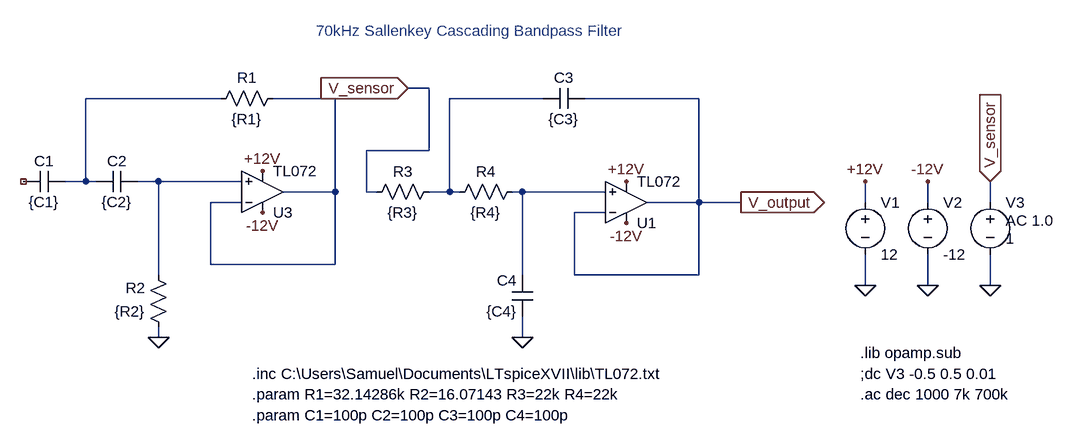
[diagram p0: schematic SallenKeyBandPassFIlter (Two Op Amp).asc]
SallenKeyBandPassFIlter (Two Op Amp).asc, the LTspice schematic file:
Version 4
SHEET 1 2508 680
WIRE -800 -528 -832 -528
WIRE -1120 -512 -1328 -512
WIRE -944 -512 -1040 -512
WIRE -624 -512 -768 -512
WIRE -384 -512 -560 -512
WIRE -800 -432 -800 -528
WIRE -800 -432 -896 -432
WIRE -1328 -384 -1328 -512
WIRE -1328 -384 -1360 -384
WIRE -1312 -384 -1328 -384
WIRE -1216 -384 -1248 -384
WIRE -1088 -384 -1216 -384
WIRE -944 -368 -944 -512
WIRE -944 -368 -1024 -368
WIRE -896 -368 -896 -432
WIRE -880 -368 -896 -368
WIRE -768 -368 -768 -512
WIRE -768 -368 -800 -368
WIRE -752 -368 -768 -368
WIRE -656 -368 -672 -368
WIRE -528 -368 -656 -368
WIRE -1088 -352 -1136 -352
WIRE -384 -352 -384 -512
WIRE -384 -352 -464 -352
WIRE -320 -352 -384 -352
WIRE -128 -352 -128 -384
WIRE -32 -352 -32 -384
WIRE 64 -352 64 -384
WIRE -528 -336 -576 -336
WIRE -1136 -256 -1136 -352
WIRE -944 -256 -944 -368
WIRE -944 -256 -1136 -256
WIRE -1216 -240 -1216 -384
WIRE -656 -240 -656 -368
WIRE -576 -240 -576 -336
WIRE -384 -240 -384 -352
WIRE -384 -240 -576 -240
WIRE -128 -224 -128 -272
WIRE -32 -224 -32 -272
WIRE 64 -224 64 -272
WIRE -1216 -144 -1216 -160
WIRE -656 -144 -656 -176
FLAG -32 -224 0
FLAG -128 -224 0
FLAG -128 -384 +12V
FLAG -32 -384 -12V
FLAG -320 -352 V_output
IOPIN -320 -352 Out
FLAG -1056 -400 +12V
FLAG -1056 -336 -12V
FLAG -832 -528 V_sensor
IOPIN -832 -528 In
FLAG 64 -224 0
FLAG 64 -384 V_sensor
IOPIN 64 -384 In
FLAG -1216 -144 0
FLAG -496 -384 +12V
FLAG -496 -320 -12V
FLAG -656 -144 0
SYMBOL voltage -128 -368 R0
WINDOW 123 0 0 Left 2
WINDOW 39 0 0 Left 2
SYMATTR InstName V1
SYMATTR Value 12
SYMBOL voltage -32 -368 R0
WINDOW 123 0 0 Left 2
WINDOW 39 0 0 Left 2
SYMATTR InstName V2
SYMATTR Value -12
SYMBOL Opamps\\opamp2 -1056 -304 M180
SYMATTR InstName U3
SYMATTR Value TL072
SYMBOL cap -1360 -400 R90
WINDOW 0 0 32 VBottom 2
WINDOW 3 32 32 VTop 2
SYMATTR InstName C1
SYMATTR Value {C1}
SYMBOL cap -1312 -368 R270
WINDOW 0 32 32 VTop 2
WINDOW 3 0 32 VBottom 2
SYMATTR InstName C2
SYMATTR Value {C2}
SYMBOL voltage 64 -368 R0
WINDOW 123 24 44 Left 2
WINDOW 39 0 0 Left 2
WINDOW 3 24 72 Left 2
SYMATTR Value2 AC 1.0
SYMATTR Value 1
SYMATTR InstName V3
SYMBOL res -1024 -528 R90
WINDOW 0 0 56 VBottom 2
WINDOW 3 32 56 VTop 2
SYMATTR InstName R1
SYMATTR Value {R1}
SYMBOL res -1200 -144 R180
WINDOW 0 36 76 Left 2
WINDOW 3 36 40 Left 2
SYMATTR InstName R2
SYMATTR Value {R2}
SYMBOL Opamps\\opamp2 -496 -288 M180
SYMATTR InstName U1
SYMATTR Value TL072
SYMBOL res -784 -384 R90
WINDOW 0 0 56 VBottom 2
WINDOW 3 32 56 VTop 2
SYMATTR InstName R3
SYMATTR Value {R3}
SYMBOL res -656 -384 R90
WINDOW 0 0 56 VBottom 2
WINDOW 3 32 56 VTop 2
SYMATTR InstName R4
SYMATTR Value {R4}
SYMBOL cap -560 -528 R90
WINDOW 0 0 32 VBottom 2
WINDOW 3 32 32 VTop 2
SYMATTR InstName C3
SYMATTR Value {C3}
SYMBOL cap -640 -176 R180
WINDOW 0 24 56 Left 2
WINDOW 3 24 8 Left 2
SYMATTR InstName C4
SYMATTR Value {C4}
TEXT -136 -120 Left 2 !.lib opamp.sub
TEXT -736 -616 Center 2 ;70kHz Sallenkey Cascading Bandpass Filter
TEXT -136 -88 Left 2 !;dc V3 -0.5 0.5 0.01
TEXT -136 -56 Left 2 !.ac dec 1000 7k 700k
TEXT -1072 -88 Left 2 !.inc C:\\Users\\Samuel\\Documents\\LTspiceXVII\\lib\\TL072.txt
TEXT -1072 -56 Left 2 !.param R1=32.14286k R2=16.07143 R3=22k R4=22k
TEXT -1072 -24 Left 2 !.param C1=100p C2=100p C3=100p C4=100p

The netlist it stands for:
* SallenKeyBandPassFIlter (Two Op Amp).asc
V1 +12V 0 12
V2 -12V 0 -12
XU3 N004 N002 -12V +12V N002 TL072  ; pins In+ In- V+ V- OUT
C1 N001 NC_01 {C1}
C2 N001 N004 {C2}
V3 V_sensor 0 1 AC 1.0
R1 N002 N001 {R1}
R2 0 N004 {R2}
XU1 N005 V_output -12V +12V V_output TL072  ; pins In+ In- V+ V- OUT
R3 N003 V_sensor {R3}
R4 N005 N003 {R4}
C3 V_output N003 {C3}
C4 0 N005 {C4}
.lib opamp.sub
* 70kHz Sallenkey Cascading Bandpass Filter
;dc V3 -0.5 0.5 0.01
.ac dec 1000 7k 700k
.inc C:\Users\Samuel\Documents\LTspiceXVII\lib\TL072.txt
.param R1=32.14286k R2=16.07143 R3=22k R4=22k
.param C1=100p C2=100p C3=100p C4=100p
.backanno
.end